# Altium schematic sheet PassiveFilter.SchDoc
size A
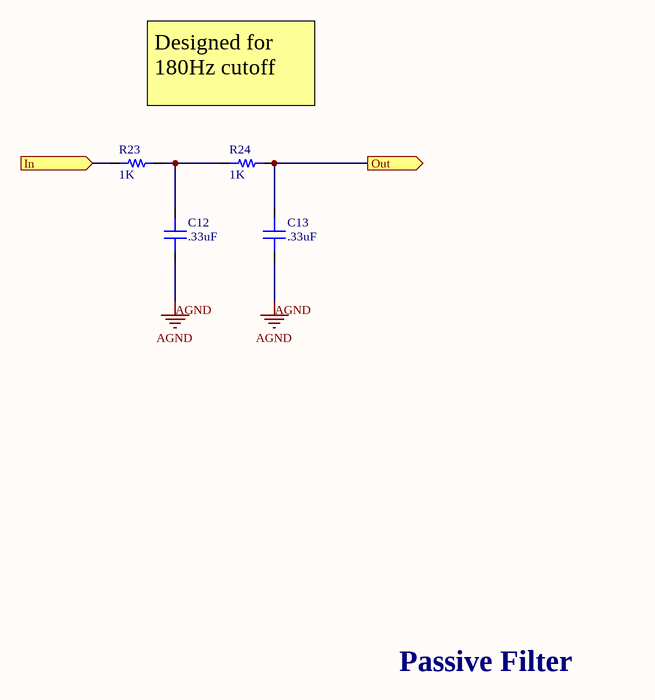
[diagram p0: PassiveFilter.SchDoc]

## Parts
C12  capacitance: .33uF  [0603]  (hidden comment: capacitor)
C13  capacitance: .33uF  [0603]  (hidden comment: capacitor)
R23  resistance: 1K  [RES 0603/1608]  (hidden comment: resistor)
R24  resistance: 1K  [RES 0603/1608]  (hidden comment: resistor)

## Ports
In (in), Out (out)

## Nets
AGND: C12.1 C13.1
In: R23.1 ; port In
Out: C13.2 R24.2 ; port Out
NetC12_2: C12.2 R23.2 R24.1

## Notes on the sheet
- Designed for 180Hz cutoff
- Passive Filter

## Library data of the parts
C12 C13 = 1: Generic 0603 capacitor; id: 1; voltage: 50; dielectric: Ceramic; percent tolerance: 10; name: 0603 Capacitor; ESR: 1; package: 0603; quantity: 0
R23 R24 = 1: id: 1; name: 0603 Resistor; percent tolerance: 5; package: 0603; quantity: 0